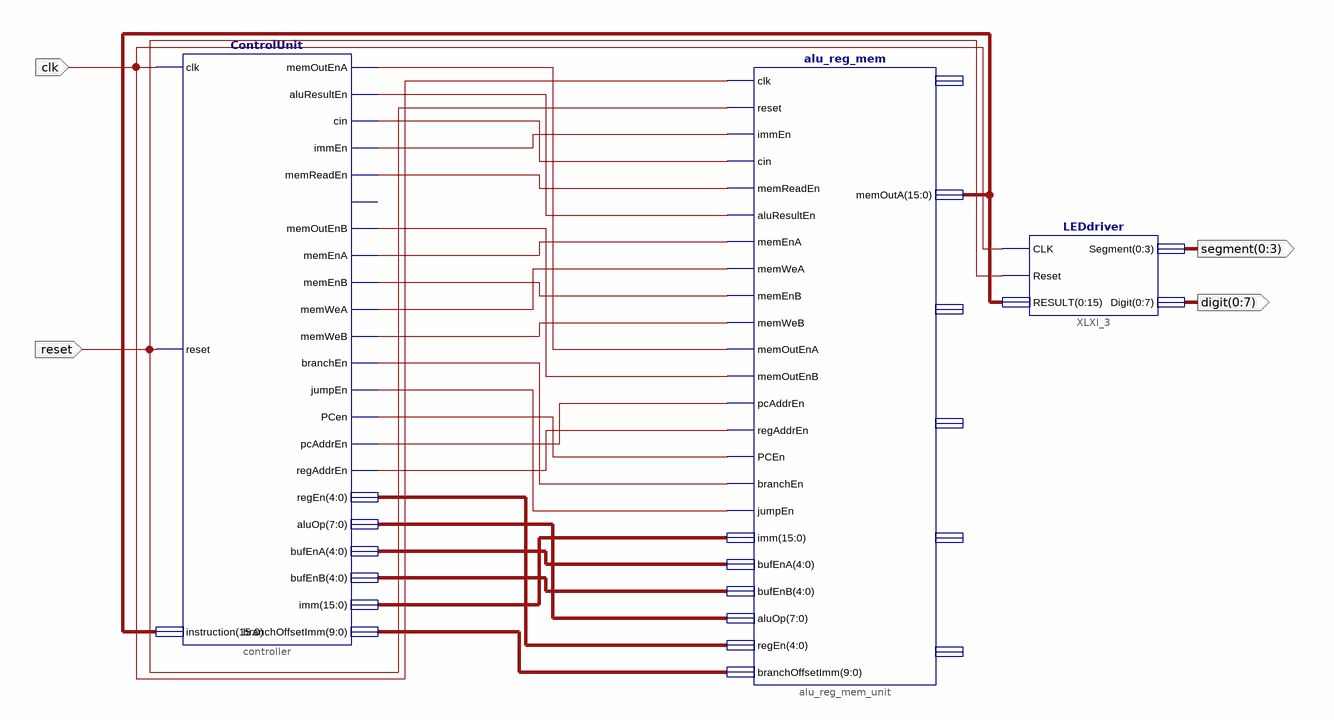
[diagram p0: schematic sheet 1]
// Xilinx ISE schematic schematic_pc_controller_aluregmem.sch (spartan6) as structural Verilog: 3 symbols, 4 ports
module schematic_pc_controller_aluregmem (
  input  clk,
  input  reset,
  output [0:3] segment,
  output [0:7] digit
);

  wire aluResultEn, branchEn, cin, immEn, jumpEn, memEnA, memEnB, memOutEnA, memOutEnB, memReadEn, memWeA,
       memWeB, pcAddrEn, PCen, regAddrEn;
  wire [4:0] bufEnA, bufEnB, regEn;
  wire [7:0] aluOp;
  wire [9:0] branchOffsetImm5;
  wire [15:0] imm, XLXN_27;

  alu_reg_mem alu_reg_mem_unit (
    .clk(clk), .reset(reset), .immEn(immEn), .cin(cin), .memReadEn(memReadEn), .aluResultEn(aluResultEn),
    .memEnA(memEnA), .memWeA(memWeA), .memEnB(memEnB), .memWeB(memWeB), .memOutEnA(memOutEnA),
    .memOutEnB(memOutEnB), .pcAddrEn(pcAddrEn), .regAddrEn(regAddrEn), .PCEn(PCen), .branchEn(branchEn),
    .jumpEn(jumpEn), .imm(imm), .bufEnA(bufEnA), .bufEnB(bufEnB), .aluOp(aluOp), .regEn(regEn),
    .branchOffsetImm(branchOffsetImm5),
    .memOutA({XLXN_27[0], XLXN_27[1], XLXN_27[2], XLXN_27[3], XLXN_27[4], XLXN_27[5], XLXN_27[6], XLXN_27[7], XLXN_27[8], XLXN_27[9], XLXN_27[10], XLXN_27[11], XLXN_27[12], XLXN_27[13], XLXN_27[14], XLXN_27[15]}));  // open: aluDataOut, memOutB, aluFlags, busBDataOut, PCOut
  ControlUnit controller (
    .clk(clk), .reset(reset),
    .instruction({XLXN_27[0], XLXN_27[1], XLXN_27[2], XLXN_27[3], XLXN_27[4], XLXN_27[5], XLXN_27[6], XLXN_27[7], XLXN_27[8], XLXN_27[9], XLXN_27[10], XLXN_27[11], XLXN_27[12], XLXN_27[13], XLXN_27[14], XLXN_27[15]}),
    .memOutEnA(memOutEnA), .aluResultEn(aluResultEn), .cin(cin), .immEn(immEn), .memReadEn(memReadEn),
    .memOutEnB(memOutEnB), .memEnA(memEnA), .memEnB(memEnB), .memWeA(memWeA), .memWeB(memWeB),
    .branchEn(branchEn), .jumpEn(jumpEn), .PCen(PCen), .pcAddrEn(pcAddrEn), .regAddrEn(regAddrEn),
    .regEn(regEn), .aluOp(aluOp), .bufEnA(bufEnA), .bufEnB(bufEnB), .imm(imm),
    .branchOffsetImm(branchOffsetImm5));  // open: aluToMemEn
  LEDdriver XLXI_3 (
    .CLK(clk), .Reset(reset),
    .RESULT({XLXN_27[0], XLXN_27[1], XLXN_27[2], XLXN_27[3], XLXN_27[4], XLXN_27[5], XLXN_27[6], XLXN_27[7], XLXN_27[8], XLXN_27[9], XLXN_27[10], XLXN_27[11], XLXN_27[12], XLXN_27[13], XLXN_27[14], XLXN_27[15]}),
    .Segment(segment), .Digit(digit));
endmodule
